# Altium schematic sheet Stepper_driver_group.SchDoc: STM32F446 CNC
size C; Author: AM; CompanyName: Expatria Technologies; DrawnBy: A.Marles; Engineer: AM; Organization: Expatria Technolgoies; Address1: PO Box 2084; Address3: Merritt, BC V1K 1B8; Address4: Canada; DocumentNumber: 11; SheetNumber: 8; SheetTotal: 26
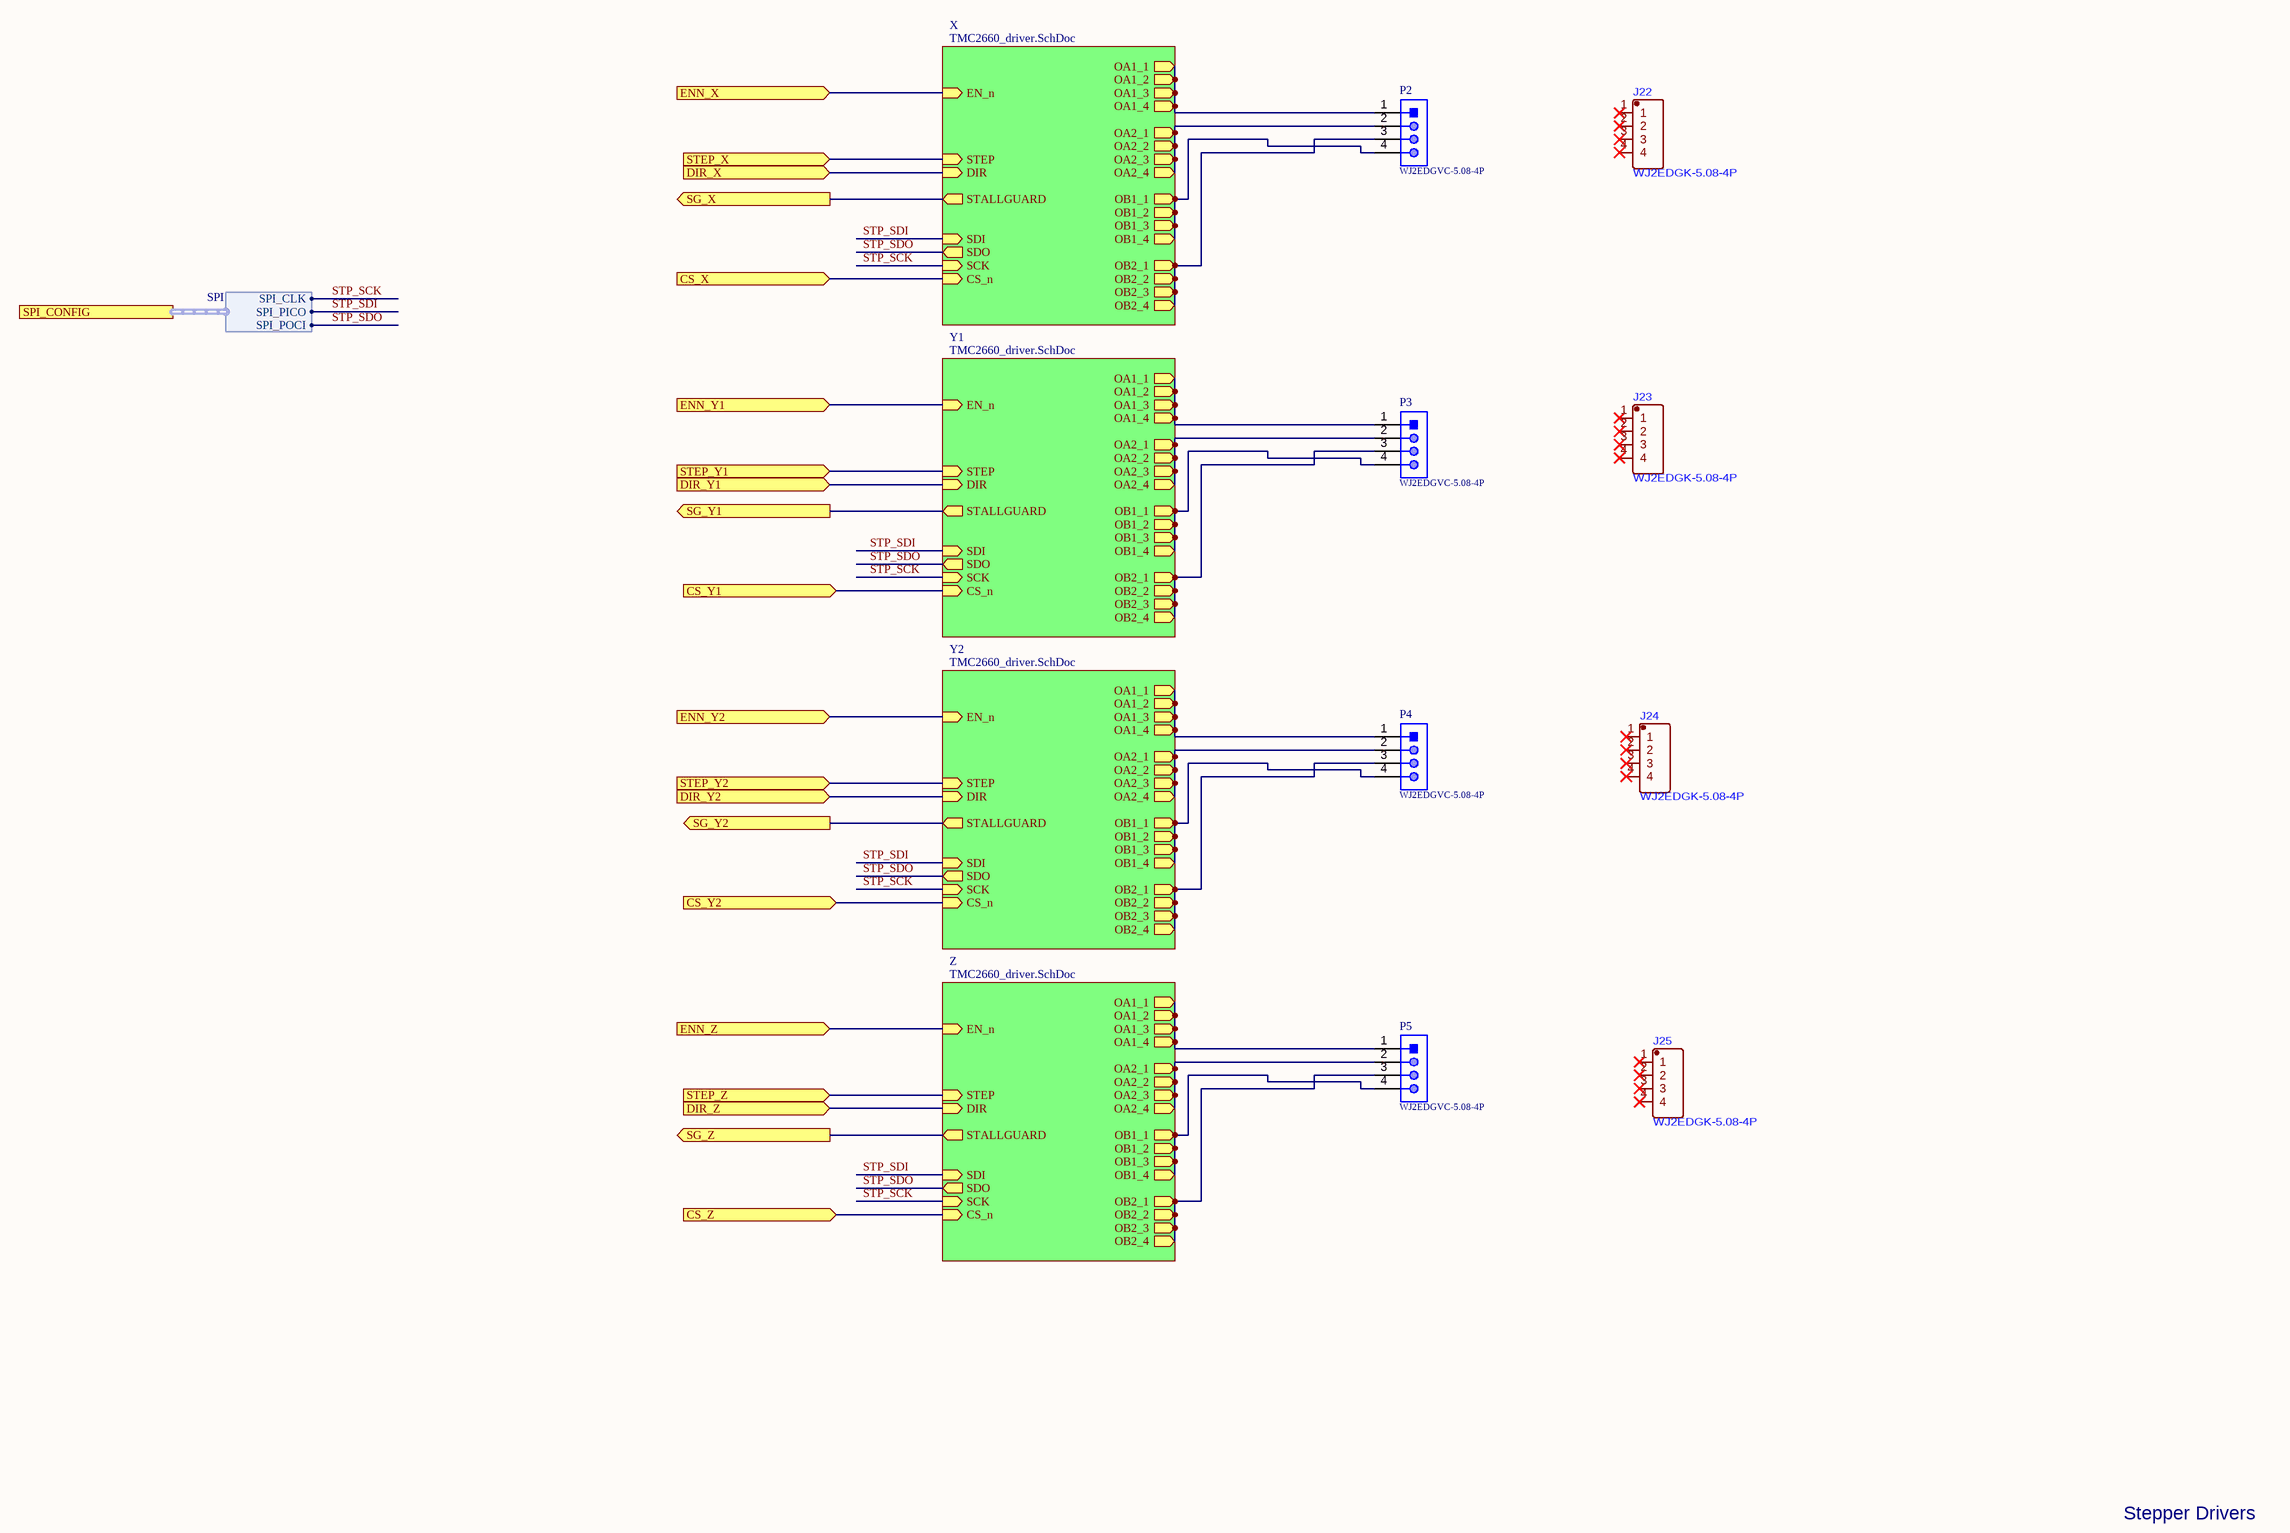
[diagram p0: Stepper_driver_group.SchDoc]

## Parts
J22  WJ2EDGK-5.08-4P  (mechanical)
J23  WJ2EDGK-5.08-4P  (mechanical)
J24  WJ2EDGK-5.08-4P  (mechanical)
J25  WJ2EDGK-5.08-4P  (mechanical)
P2  WJ2EDGVC-5.08-4P  [WJ2EDGVC-5.08-4P]
P3  WJ2EDGVC-5.08-4P  [WJ2EDGVC-5.08-4P]
P4  WJ2EDGVC-5.08-4P  [WJ2EDGVC-5.08-4P]
P5  WJ2EDGVC-5.08-4P  [WJ2EDGVC-5.08-4P]

## Sub-sheets
X = TMC2660_driver.SchDoc: SCK (in), OA2_4 (out), EN_n (in), OB1_1 (out), OA1_2 (out), OB2_3 (out), STEP (in), OB2_1 (out), OB1_4 (out), DIR (in), STALLGUARD (out), SDI (in), SDO (out), OA1_1 (out), OB2_4 (out), OA2_1 (out), OB1_2 (out), OA1_3 (out), OB1_3 (out), OB2_2 (out), OA2_2 (out), OA1_4 (out), OA2_3 (out), CS_n (in)
Y1 = TMC2660_driver.SchDoc: SCK (in), OA2_4 (out), EN_n (in), OB1_1 (out), OA1_2 (out), OB2_3 (out), STEP (in), OB2_1 (out), OB1_4 (out), DIR (in), STALLGUARD (out), SDI (in), SDO (out), OA1_1 (out), OB2_4 (out), OA2_1 (out), OB1_2 (out), OA1_3 (out), OB1_3 (out), OB2_2 (out), OA2_2 (out), OA1_4 (out), OA2_3 (out), CS_n (in)
Y2 = TMC2660_driver.SchDoc: SCK (in), OA2_4 (out), EN_n (in), OB1_1 (out), OA1_2 (out), OB2_3 (out), STEP (in), OB2_1 (out), OB1_4 (out), DIR (in), STALLGUARD (out), SDI (in), SDO (out), OA1_1 (out), OB2_4 (out), OA2_1 (out), OB1_2 (out), OA1_3 (out), OB1_3 (out), OB2_2 (out), OA2_2 (out), OA1_4 (out), OA2_3 (out), CS_n (in)
Z = TMC2660_driver.SchDoc: SCK (in), OA2_4 (out), EN_n (in), OB1_1 (out), OA1_2 (out), OB2_3 (out), STEP (in), OB2_1 (out), OB1_4 (out), DIR (in), STALLGUARD (out), SDI (in), SDO (out), OA1_1 (out), OB2_4 (out), OA2_1 (out), OB1_2 (out), OA1_3 (out), OB1_3 (out), OB2_2 (out), OA2_2 (out), OA1_4 (out), OA2_3 (out), CS_n (in)

## Ports
CS_X (in), CS_Y1 (in), CS_Y2 (in), CS_Z (in), DIR_X (in), DIR_Y1 (in), DIR_Y2 (in), DIR_Z (in), ENN_X (in), ENN_Y1 (in), ENN_Y2 (in), ENN_Z (in), SG_X (out), SG_Y1 (out), SG_Y2 (out), SG_Z (out), SPI_CONFIG (harness SPI), STEP_X (in), STEP_Y1 (in), STEP_Y2 (in), STEP_Z (in)

## Harnesses
SPI: SPI_CLK, SPI_PICO, SPI_POCI

## Nets
CS_X: port CS_X, sheet X/CS_n
CS_Y1: port CS_Y1, sheet Y1/CS_n
CS_Y2: port CS_Y2, sheet Y2/CS_n
CS_Z: port CS_Z, sheet Z/CS_n
DIR_X: port DIR_X, sheet X/DIR
DIR_Y1: port DIR_Y1, sheet Y1/DIR
DIR_Y2: port DIR_Y2, sheet Y2/DIR
DIR_Z: port DIR_Z, sheet Z/DIR
ENN_X: port ENN_X, sheet X/EN_n
ENN_Y1: port ENN_Y1, sheet Y1/EN_n
ENN_Y2: port ENN_Y2, sheet Y2/EN_n
ENN_Z: port ENN_Z, sheet Z/EN_n
SG_X: port SG_X, sheet X/STALLGUARD
SG_Y1: port SG_Y1, sheet Y1/STALLGUARD
SG_Y2: port SG_Y2, sheet Y2/STALLGUARD
SG_Z: port SG_Z, sheet Z/STALLGUARD
STEP_X: port STEP_X, sheet X/STEP
STEP_Y1: port STEP_Y1, sheet Y1/STEP
STEP_Y2: port STEP_Y2, sheet Y2/STEP
STEP_Z: port STEP_Z, sheet Z/STEP
STP_SCK: sheet X/SCK, sheet Y1/SCK, sheet Y2/SCK, sheet Z/SCK, port SPI_CONFIG.SPI_CLK
STP_SDI: sheet X/SDI, sheet Y1/SDI, sheet Y2/SDI, sheet Z/SDI, port SPI_CONFIG.SPI_PICO
STP_SDO: sheet X/SDO, sheet Y1/SDO, sheet Y2/SDO, sheet Z/SDO, port SPI_CONFIG.SPI_POCI
NetP2_1: P2.1 ; sheet X/OA1_2, sheet X/OA1_1, sheet X/OA1_3, sheet X/OA1_4
NetP2_2: P2.2 ; sheet X/OA2_4, sheet X/OA2_1, sheet X/OA2_2, sheet X/OA2_3
NetP2_3: P2.3 ; sheet X/OB2_3, sheet X/OB2_1, sheet X/OB2_4, sheet X/OB2_2
NetP2_4: P2.4 ; sheet X/OB1_1, sheet X/OB1_4, sheet X/OB1_2, sheet X/OB1_3
NetP3_1: P3.1 ; sheet Y1/OA1_2, sheet Y1/OA1_1, sheet Y1/OA1_3, sheet Y1/OA1_4
NetP3_2: P3.2 ; sheet Y1/OA2_4, sheet Y1/OA2_1, sheet Y1/OA2_2, sheet Y1/OA2_3
NetP3_3: P3.3 ; sheet Y1/OB2_3, sheet Y1/OB2_1, sheet Y1/OB2_4, sheet Y1/OB2_2
NetP3_4: P3.4 ; sheet Y1/OB1_1, sheet Y1/OB1_4, sheet Y1/OB1_2, sheet Y1/OB1_3
NetP4_1: P4.1 ; sheet Y2/OA1_2, sheet Y2/OA1_1, sheet Y2/OA1_3, sheet Y2/OA1_4
NetP4_2: P4.2 ; sheet Y2/OA2_4, sheet Y2/OA2_1, sheet Y2/OA2_2, sheet Y2/OA2_3
NetP4_3: P4.3 ; sheet Y2/OB2_3, sheet Y2/OB2_1, sheet Y2/OB2_4, sheet Y2/OB2_2
NetP4_4: P4.4 ; sheet Y2/OB1_1, sheet Y2/OB1_4, sheet Y2/OB1_2, sheet Y2/OB1_3
NetP5_1: P5.1 ; sheet Z/OA1_2, sheet Z/OA1_1, sheet Z/OA1_3, sheet Z/OA1_4
NetP5_2: P5.2 ; sheet Z/OA2_4, sheet Z/OA2_1, sheet Z/OA2_2, sheet Z/OA2_3
NetP5_3: P5.3 ; sheet Z/OB2_3, sheet Z/OB2_1, sheet Z/OB2_4, sheet Z/OB2_2
NetP5_4: P5.4 ; sheet Z/OB1_1, sheet Z/OB1_4, sheet Z/OB1_2, sheet Z/OB1_3

Not connected (* = marked no-connect by the designer): J22 1* 2* 3* 4*; J23 1* 2* 3* 4*; J24 1* 2* 3* 4*; J25 1* 2* 3* 4*

## Notes on the sheet
- Stepper Drivers
- Expatria Technologies
- SHEET
- PROJECT
- REV
- EMAIL: INFO@EXPATRIA.CA
- 625 Kane Valley Rd.
- Box 2084
- Merritt, BC V1K1B8
- SIZE
- ENGR
- C
- MODIFIED
- DOCUMENT
- /
- Copyright Sienci Labs 2024. This document describes Open Hardware and is licensed under the CERN-OHL-S v2. No warranty is implied or expressed.

## Library data of the parts
J22-J25 = WJ2EDGK-5.08-4P: 4 1 5.08mm Green Plug P=5.08mm Pluggable System Terminal Block ROHS; Manufacturer: Ningbo; Manufacturer Part Number: WJ2EDGK-5.08-4P; SuppliersPartNumber: C71372; Supplier: LCSC; Value: WJ2EDGK-5.08-4P
P2-P5 = WJ2EDGVC-5.08-4P: 4 Straight pin 1 5.08mm Green Board Edge/Receptacle-Close Straight,P=5.08mm Pluggable System Terminal Block ROHS; Manufacturer: Ningbo Kangnex Elec; Supplier Part Number 1: C8436; Manufacturer Part Number: WJ2EDGVC-5.08-4P; RoHS: Yes; Category: Terminals; SuppliersPartNumber: C8436; Supplier 1: LCSC